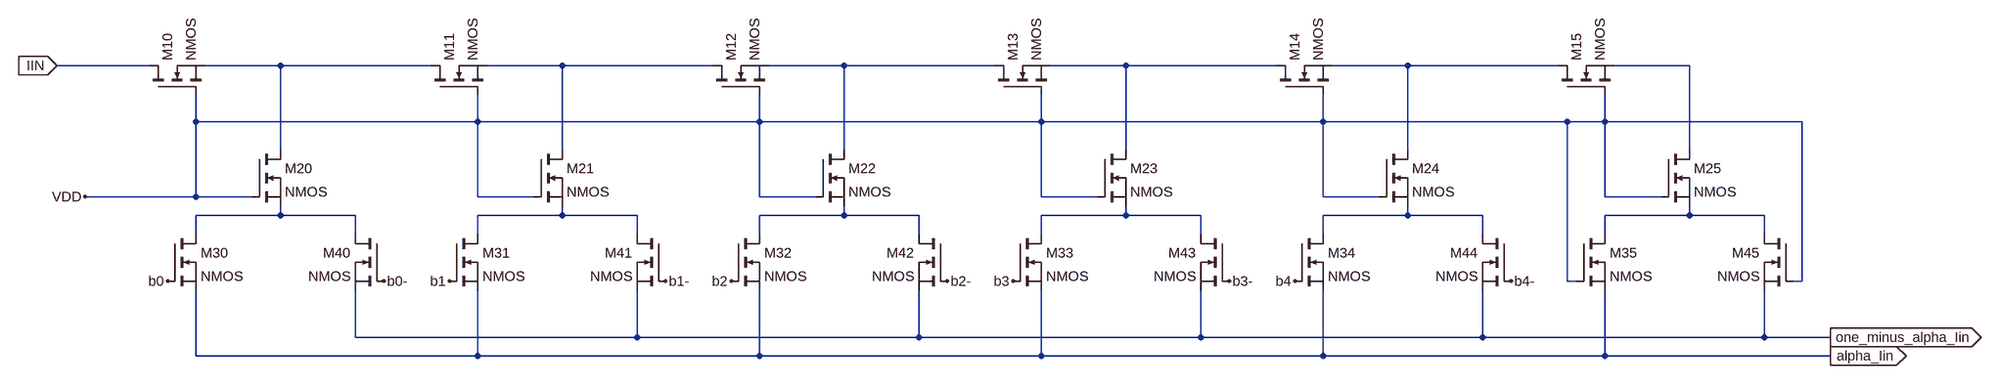
[diagram p0: schematic CDN.asc]
CDN.asc, the LTspice schematic file:
Version 4
SHEET 1 3136 772
WIRE 0 176 -160 176
WIRE 224 176 96 176
WIRE 480 176 224 176
WIRE 704 176 576 176
WIRE 960 176 704 176
WIRE 1184 176 1056 176
WIRE 1440 176 1184 176
WIRE 1664 176 1536 176
WIRE 1920 176 1664 176
WIRE 2144 176 2016 176
WIRE 2400 176 2144 176
WIRE 2624 176 2496 176
WIRE 80 272 80 224
WIRE 560 272 560 224
WIRE 560 272 80 272
WIRE 1040 272 1040 224
WIRE 1040 272 560 272
WIRE 1520 272 1520 224
WIRE 1520 272 1040 272
WIRE 2000 272 2000 224
WIRE 2000 272 1520 272
WIRE 2416 272 2000 272
WIRE 2480 272 2480 224
WIRE 2480 272 2416 272
WIRE 2816 272 2480 272
WIRE 224 320 224 176
WIRE 704 320 704 176
WIRE 1184 320 1184 176
WIRE 1664 320 1664 176
WIRE 2144 320 2144 176
WIRE 2624 320 2624 176
WIRE 80 400 80 272
WIRE 80 400 -112 400
WIRE 176 400 80 400
WIRE 560 400 560 272
WIRE 656 400 560 400
WIRE 1040 400 1040 272
WIRE 1136 400 1040 400
WIRE 1520 400 1520 272
WIRE 1616 400 1520 400
WIRE 2000 400 2000 272
WIRE 2096 400 2000 400
WIRE 2480 400 2480 272
WIRE 2576 400 2480 400
WIRE 224 432 224 416
WIRE 224 432 80 432
WIRE 352 432 224 432
WIRE 704 432 704 416
WIRE 704 432 560 432
WIRE 832 432 704 432
WIRE 1184 432 1184 416
WIRE 1184 432 1040 432
WIRE 1312 432 1184 432
WIRE 1664 432 1664 416
WIRE 1664 432 1520 432
WIRE 1792 432 1664 432
WIRE 2144 432 2144 416
WIRE 2144 432 2000 432
WIRE 2272 432 2144 432
WIRE 2624 432 2624 416
WIRE 2624 432 2480 432
WIRE 2752 432 2624 432
WIRE 80 464 80 432
WIRE 352 464 352 432
WIRE 560 464 560 432
WIRE 832 464 832 432
WIRE 1040 464 1040 432
WIRE 1312 464 1312 432
WIRE 1520 464 1520 432
WIRE 1792 464 1792 432
WIRE 2000 464 2000 432
WIRE 2272 464 2272 432
WIRE 2480 464 2480 432
WIRE 2752 464 2752 432
WIRE 2416 544 2416 272
WIRE 2432 544 2416 544
WIRE 2816 544 2816 272
WIRE 2816 544 2800 544
WIRE 352 640 352 560
WIRE 832 640 832 560
WIRE 832 640 352 640
WIRE 1312 640 1312 560
WIRE 1312 640 832 640
WIRE 1792 640 1792 560
WIRE 1792 640 1312 640
WIRE 2272 640 2272 560
WIRE 2272 640 1792 640
WIRE 2752 640 2752 560
WIRE 2752 640 2272 640
WIRE 2864 640 2752 640
WIRE 80 672 80 560
WIRE 560 672 560 560
WIRE 560 672 80 672
WIRE 1040 672 1040 560
WIRE 1040 672 560 672
WIRE 1520 672 1520 560
WIRE 1520 672 1040 672
WIRE 2000 672 2000 560
WIRE 2000 672 1520 672
WIRE 2480 672 2480 560
WIRE 2480 672 2000 672
WIRE 2864 672 2480 672
FLAG -160 176 IIN
IOPIN -160 176 In
FLAG -112 400 VDD
FLAG 2864 672 alpha_Iin
IOPIN 2864 672 Out
FLAG 2864 640 one_minus_alpha_Iin
IOPIN 2864 640 Out
FLAG 32 544 b0
FLAG 512 544 b1
FLAG 400 544 b0-
FLAG 880 544 b1-
FLAG 992 544 b2
FLAG 1360 544 b2-
FLAG 1472 544 b3
FLAG 1840 544 b3-
FLAG 1952 544 b4
FLAG 2320 544 b4-
SYMBOL nmos 176 320 R0
SYMATTR InstName M20
SYMBOL nmos 0 224 R270
SYMATTR InstName M10
SYMBOL nmos 32 464 R0
SYMATTR InstName M30
SYMBOL nmos 400 464 M0
SYMATTR InstName M40
SYMBOL nmos 480 224 R270
SYMATTR InstName M11
SYMBOL nmos 960 224 R270
SYMATTR InstName M12
SYMBOL nmos 1440 224 R270
SYMATTR InstName M13
SYMBOL nmos 1920 224 R270
SYMATTR InstName M14
SYMBOL nmos 656 320 R0
SYMATTR InstName M21
SYMBOL nmos 1136 320 R0
SYMATTR InstName M22
SYMBOL nmos 1616 320 R0
SYMATTR InstName M23
SYMBOL nmos 512 464 R0
SYMATTR InstName M31
SYMBOL nmos 992 464 R0
SYMATTR InstName M32
SYMBOL nmos 1472 464 R0
SYMATTR InstName M33
SYMBOL nmos 880 464 M0
SYMATTR InstName M41
SYMBOL nmos 1360 464 M0
SYMATTR InstName M42
SYMBOL nmos 1840 464 M0
SYMATTR InstName M43
SYMBOL nmos 1952 464 R0
SYMATTR InstName M34
SYMBOL nmos 2432 464 R0
SYMATTR InstName M35
SYMBOL nmos 2320 464 M0
SYMATTR InstName M44
SYMBOL nmos 2800 464 M0
SYMATTR InstName M45
SYMBOL nmos 2096 320 R0
SYMATTR InstName M24
SYMBOL nmos 2576 320 R0
SYMATTR InstName M25
SYMBOL nmos 2400 224 R270
SYMATTR InstName M15

The netlist it stands for:
* CDN.asc
M20 N001 VDD N007 N007 NMOS
M10 IIN VDD N001 N001 NMOS
M30 N007 b0 alpha_Iin alpha_Iin NMOS
M40 N007 b0- one_minus_alpha_Iin one_minus_alpha_Iin NMOS
M11 N001 VDD N002 N002 NMOS
M12 N002 VDD N003 N003 NMOS
M13 N003 VDD N004 N004 NMOS
M14 N004 VDD N005 N005 NMOS
M21 N002 VDD N008 N008 NMOS
M22 N003 VDD N009 N009 NMOS
M23 N004 VDD N010 N010 NMOS
M31 N008 b1 alpha_Iin alpha_Iin NMOS
M32 N009 b2 alpha_Iin alpha_Iin NMOS
M33 N010 b3 alpha_Iin alpha_Iin NMOS
M41 N008 b1- one_minus_alpha_Iin one_minus_alpha_Iin NMOS
M42 N009 b2- one_minus_alpha_Iin one_minus_alpha_Iin NMOS
M43 N010 b3- one_minus_alpha_Iin one_minus_alpha_Iin NMOS
M34 N011 b4 alpha_Iin alpha_Iin NMOS
M35 N012 VDD alpha_Iin alpha_Iin NMOS
M44 N011 b4- one_minus_alpha_Iin one_minus_alpha_Iin NMOS
M45 N012 VDD one_minus_alpha_Iin one_minus_alpha_Iin NMOS
M24 N005 VDD N011 N011 NMOS
M25 N006 VDD N012 N012 NMOS
M15 N005 VDD N006 N006 NMOS
.model NMOS NMOS
.model PMOS PMOS
.lib standard.mos
.backanno
.end